# Altium project LT3083.PrjPcb
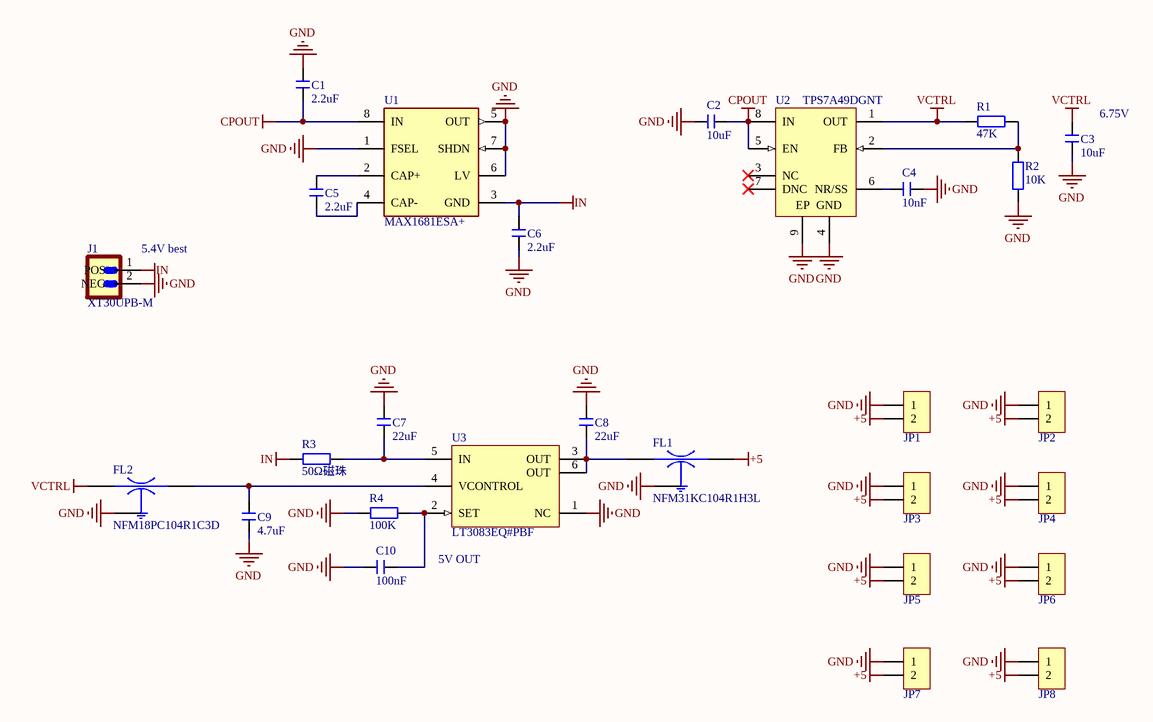
[diagram p0: LT3083.SchDoc]
1 sheet, 28 parts. Net scope: global (net labels, ports and power ports of the same name join across sheets).
Board file: LT3083.PcbDoc

## Sheet LT3083.SchDoc
size A2; SheetNumber: 1; SheetTotal: 1

### Parts
C1  2.2uF  [C 0603_L]
C2  10uF  [C 0805_L]
C3  10uF  [C 0805_L]
C4  10nF  [C 0603_L]
C5  2.2uF  [C 0603_L]
C6  2.2uF  [C 0603_L]
C7  22uF  [C 1206_L]
C8  22uF  [C 1206_L]
C9  4.7uF  [C 0603_L]
C10  100nF  [C 0603_L]
FL1  NFM31KC104R1H3L  [FIL_NFM31KC104R1H3L]
FL2  NFM18PC104R1C3D  [FIL_NFM18PC104R1C3D]
J1  XT30UPB-M  [XT30UPB-M]
JP1  HDR-1X2  [KF2510-LI-2P]  (value not drawn)
JP2  HDR-1X2  [KF2510-LI-2P]  (value not drawn)
JP3  HDR-1X2  [KF2510-LI-2P]  (value not drawn)
JP4  HDR-1X2  [KF2510-LI-2P]  (value not drawn)
JP5  HDR-1X2  [KF2510-LI-2P]  (value not drawn)
JP6  HDR-1X2  [KF2510-LI-2P]  (value not drawn)
JP7  HDR-1X2  [KF2510-LI-2P]  (value not drawn)
JP8  HDR-1X2  [KF2510-LI-2P]  (value not drawn)
R1  47K  [R 0603_L]
R2  10K  [R 0603_L]
R3  50Ω磁珠  [R 1206_L]
R4  100K  [R 0603_L]
U1  MAX1681ESA+  [FP-S8-5-MFG]
U2  TPS7A49DGNT  [DGN0008D_N]
U3  LT3083EQ#PBF  [LT-Q-5_N]

### Nets
+5: FL1.3(OUT) JP1.2 JP2.2 JP3.2 JP4.2 JP5.2 JP6.2 JP7.2 JP8.2
CPOUT: C1.1 C2.2 U1.8(IN) U2.5(EN) U2.8(IN)
GND: C1.2 C2.1 C3.2 C4.1 C6.1 C7.2 C8.2 C9.1 C10.1 FL1.2(GND) FL2.2(GND) J1.2(NEG) JP1.1 JP2.1 JP3.1 JP4.1 JP5.1 JP6.1 JP7.1 JP8.1 R2.2 R4.1 U1.1(FSEL) U1.5(OUT) U1.6(LV) U1.7(SHDN) U2.4(GND) U2.9(EP) U3.1(NC)
IN: C6.2 J1.1(POS) R3.1 U1.3(GND)
VCTRL: C3.1 FL2.1(IN) R1.2 U2.1(OUT)
NetC4_2: C4.2 U2.6(NR/SS)
NetC5_1: C5.1 U1.4(CAP-)
NetC5_2: C5.2 U1.2(CAP+)
NetC7_1: C7.1 R3.2 U3.5(IN)
NetC8_1: C8.1 FL1.1(IN) U3.3(OUT) U3.6(OUT)
NetC9_2: C9.2 FL2.3(OUT) U3.4(VCONTROL)
NetC10_2: C10.2 R4.2 U3.2(SET)
NetR1_1: R1.1 R2.1 U2.2(FB)

Not connected (* = marked no-connect by the designer): U2 3(NC)* 7(DNC)*

### Notes on the sheet
- (near C3) 6.75V
- (near J1) 5.4V best
- 5V OUT

### Library data of the parts
C1-C10 = C: 贴片电容; 淘宝ID: 小糖豆的小窝窝; BOM名称: 贴片电容; 下单链接: https://item.taobao.com/item.htm?ft=t&id=613637044352
FL1 = NFM31KC104R1H3L: SMD Capacitor with Capacitance: 0.10uF Tol. 20%. Rated Voltage: 50Vdc; MF: Murata; Package: NONSTANDARD; MP: NFM31KC104R1H3L; Price: None; Availability: Unavailable; Value: *; SnapEDA_Link: https://www.snapeda.com/parts/NFM31KC104R1H3L/Murata/view-part/4377127/?ref=snap
FL2 = NFM18PC104R1C3D: SMD Capacitor with Capacitance: 0.10uF Tol. 20%. Rated Voltage: 16Vdc; MF: Murata; Digi-Key_Part_Number: 490-6969-1-ND; SnapEDA_Link: https://www.snapeda.com/parts/NFM18PC104R1C3D/Murata/view-part/4375738/?ref=snap; Package: NONSTANDARD; MP: NFM18PC104R1C3D; Digi-Key_Purchase_URL: https://www.digikey.com/product-detail/en/murata-electronics/NFM18PC104R1C3D/490-6969-1-ND/3846166?utm_source=snapeda&utm_medium=aggregator&utm_campaign=symbol; Value: *
J1 = XT30UPB-M: Socket; DC supply; XT30; male; PIN: 2; on PCBs; THT; yellow; 15A; 500V; MF: amass; Price: None; Value: *; Package: None; MP: XT30UPB-M; Availability: Not in stock
JP1-JP8 = Header 2: 2P接插件; 淘宝ID: 小糖豆的小窝窝; BOM名称: 2P接插件; 下单链接: https://item.taobao.com/item.htm?ft=t&id=613637044352
R1-R4 = R: 贴片电阻; 淘宝ID: 小糖豆的小窝窝; BOM名称: 贴片电阻; 下单链接: https://item.taobao.com/item.htm?ft=t&id=613637044352
U1 = MAX1681ESA: IC REG CHARGE PUMP INV 8SOIC; Manufacturer: Maxim; Output Voltage: -5.5/+11V; Max Junction Temp: +150°C; Output Type: Other; Nominal Supply Current: 10-20mA; Switching Frequency: 500/1000kHz; Standoff Height: 0.1mm; Output Current: 125mA; Min Supply Voltage: 3V; Number Of Outputs: 1; Negative Voltage Available: true; Max Power Dissipation: 471mW; Max Supply Voltage: 5.5V; Temperature Range High: +85°C; Switching Topology: Charge Pump; Category: IC; Device Class L3: Voltage Regulators - Switching; Mouser Description: Switching Voltage Regulators 125mA f-Select Swtcd Voltage Converter; Footprint Url: https://pdfserv.maximintegrated.com/land_patterns/90-0096.PDF; Digikey Description: IC REG CHARGE PUMP INV 8SOIC; Lead Free: Yes; Temperature: -40°C to +85°C; Automotive: No; Temperature Range Low: -40°C; ComponentLink2Description: Datasheet; Height: 1.75mm; Octopart: https://octopart.com/max1681esa%2B-maxim+integrated-39580721; Device Class L2: Power Management ICs; RoHS: TRUE; Package: S8-5; ComponentLink2URL: https://datasheets.maximintegrated.com/en/ds/MAX1680-MAX1681.pdf; Device Class L1: Integrated Circuits (ICs); Manufacturer Part Number: MAX1681ESA+
U2 = TPS7A49: Single Output High PSRR LDO, 150 mA, Adjustable 1.2 to 33 V Output, 3 to 36 V Input, with Ultra-Low Noise, 8-pin MSOP (DGN), -40 to 125 degC, Green (RoHS & no Sb/Br); Manufacturer: Texas Instruments; PartNumber: TPS7A4901DGNT; Vout Adj(Min)(V): 1.2; Vout Adj(Max)(V): 33; SubFamily: Single Channel LDO; Vin(Max)(V): 36; Iq(Typ)(mA): 0.06; Power Good: TRUE; Vdo(Typ)(mV): 260; Accuracy(%): 1.5; Iout(Max)(A): 0.15; Vin(Min)(V): 3; PackageDescription: 8-pin Plastic Small Outline, Body 3 x 3 mm, Pitch 0.65 mm; Code_JEDEC: MO-187; ComponentLink2URL: http://www.ti.com/general/docs/lit/getliterature.tsp?genericPartNumber=TPS7A4901&fileType=pdf; Mounting Technology: Surface Mount; PackageVersion: 4073271/F; ComponentLink1URL: http://www.ti.com/; PackageReference: DGN0008D; Eco-Plan: Green (RoHS & no Sb/Br); DatasheetVersion: SBVS121B; ComponentLink2Description: Datasheet; ComponentLink3Description: Package Specification; ComponentLink1Description: Manufacturer URL; ComponentLink3URL: http://www.ti.com/litv/pdf/mpds046e
U3 = LT3083EQ: 3 A Single Resistor Low Dropout Regulator, 1.2 to 23 V Vin, Adjustable Vout, 5-pin DPAK (Q-5), -40 to 125 degC, Pb-Free; Manufacturer: Linear Technology; Vin Max(V): 23; Number of Outputs: 1; Discrete Pass Element: no; Iout(mA): 3000; Vin Min(V): 1.2; Shutdown Current(uA): 0; Noise(uV): 40; Isupply(mA): 0.35; PSRR(dB): 85; Output Voltage: Adj; Dropout Voltage(V): 0.31; Mounting Technology: Surface Mount; PackageReference: Q-5; ComponentLink2URL: http://cds.linear.com/docs/en/datasheet/3083fa.pdf; ComponentLink2Description: Datasheet; ComponentLink3Description: Package Specification; Vout Max(V): 23; Vout Min(V): 0; ComponentLink1URL: http://www.linear.com/; RoHS: TRUE; PackageVersion: Rev. F, 09/2011; PartNumber: LT3083EQ#PBF; ComponentLink1Description: Manufacturer URL; ComponentLink3URL: http://cds.linear.com/docs/en/packaging/Q%20DD5%2005-08-1461%20Rev%20F.pdf; DatasheetVersion: Rev. A; PackageDescription: 5-Pin Plastic DD Pak, Body 10.2235 x 8.89 mm, Pitch 1.702 mm